# Altium schematic sheet Control.SchDoc
size A4
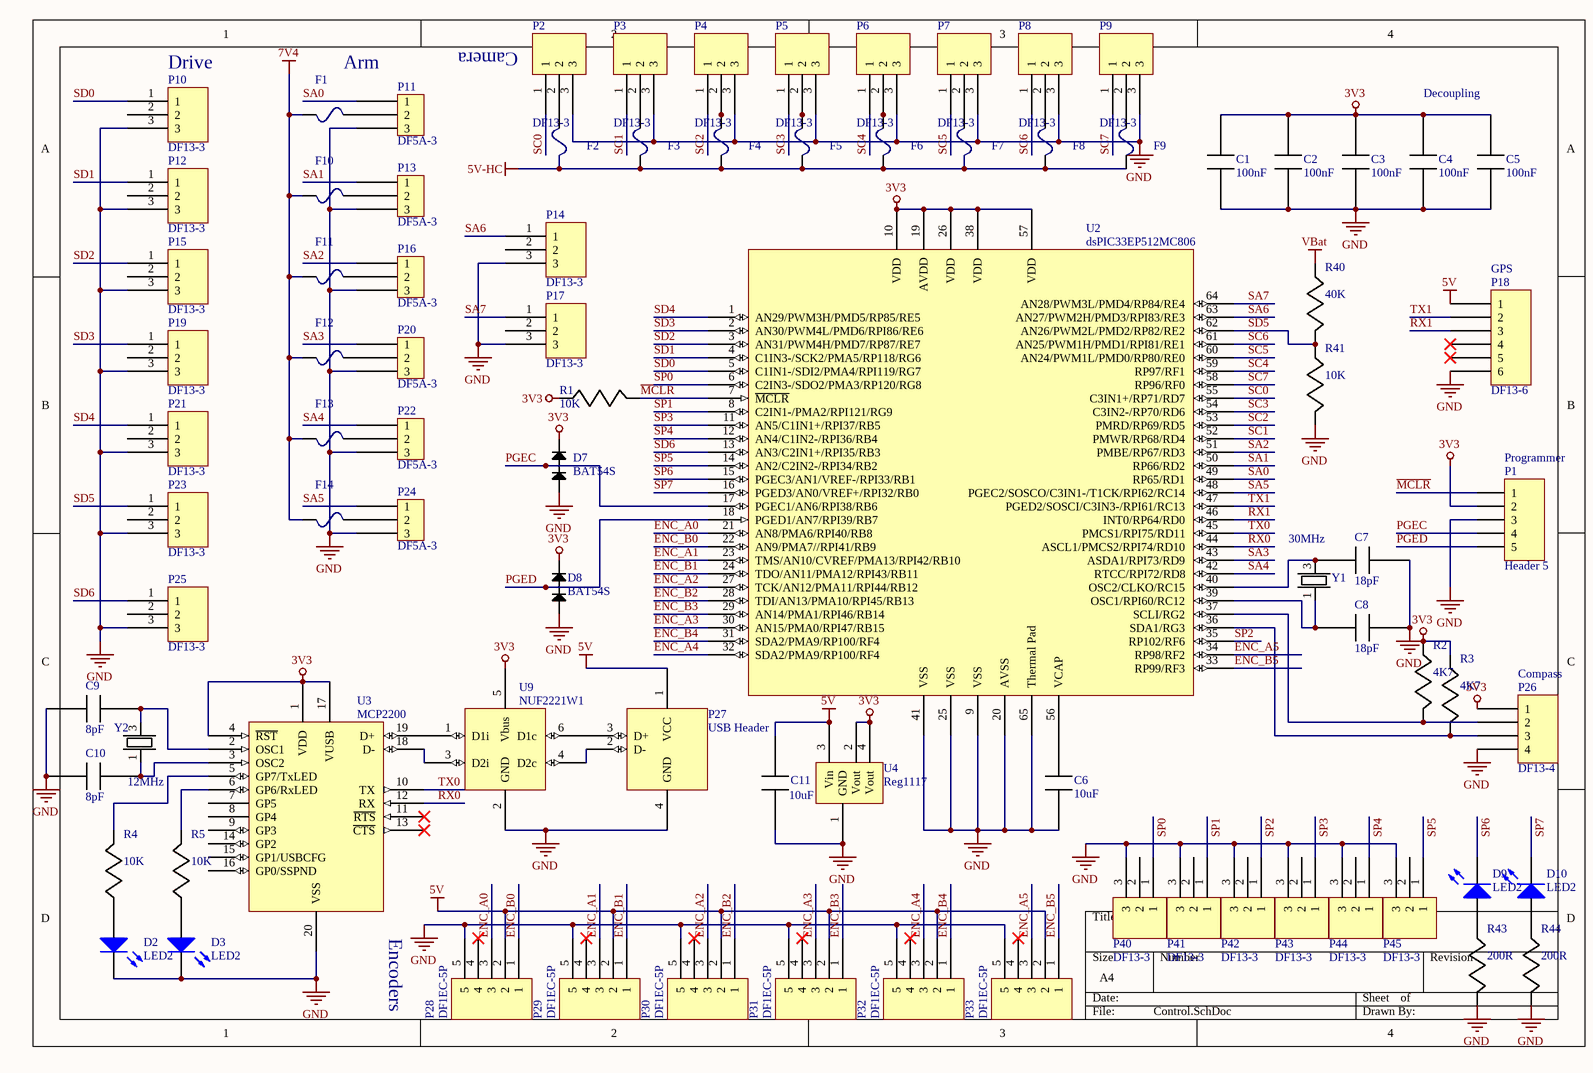
[diagram p0: Control.SchDoc]

## Parts
C1  100nF  [1608[0603]]
C2  100nF  [1608[0603]]
C3  100nF  [1608[0603]]
C4  100nF  [1608[0603]]
C5  100nF  [1608[0603]]
C6  10uF  [1608[0603]]
C7  18pF  [1608[0603]]
C8  18pF  [1608[0603]]
C9  8pF  [1608[0603]]
C10  8pF  [1608[0603]]
C11  Size: 10uF  [1608[0603]]
D2  LED2  [3.2X1.6X1.1]
D3  LED2  [3.2X1.6X1.1]
D7  BAT54S  [SOT90P240X110-3N]
D8  BAT54S  [SOT90P240X110-3N]
D9  LED2  [1608[0603]]
D10  LED2  [1608[0603]]
F1  RSTA 2-BULK  [56400001009]  (value not drawn)
F2  RSTA 2-BULK  [56400001009]  (value not drawn)
F3  RSTA 2-BULK  [56400001009]  (value not drawn)
F4  RSTA 2-BULK  [56400001009]  (value not drawn)
F5  RSTA 2-BULK  [56400001009]  (value not drawn)
F6  RSTA 2-BULK  [56400001009]  (value not drawn)
F7  RSTA 2-BULK  [56400001009]  (value not drawn)
F8  RSTA 2-BULK  [56400001009]  (value not drawn)
F9  RSTA 2-BULK  [56400001009]  (value not drawn)
F10  RSTA 2-BULK  [56400001009]  (value not drawn)
F11  RSTA 2-BULK  [56400001009]  (value not drawn)
F12  RSTA 2-BULK  [56400001009]  (value not drawn)
F13  RSTA 2-BULK  [56400001009]  (value not drawn)
F14  RSTA 2-BULK  [56400001009]  (value not drawn)
P1  Header 5  [HDR1X5]
P2  DF13-3  [DF13-3]
P3  DF13-3  [DF13-3]
P4  DF13-3  [DF13-3]
P5  DF13-3  [DF13-3]
P6  DF13-3  [DF13-3]
P7  DF13-3  [DF13-3]
P8  DF13-3  [DF13-3]
P9  DF13-3  [DF13-3]
P10  DF13-3  [DF13-3]
P11  DF5A-3  [DF5A-3]
P12  DF13-3  [DF13-3]
P13  DF5A-3  [DF5A-3]
P14  DF13-3  [DF13-3]
P15  DF13-3  [DF13-3]
P16  DF5A-3  [DF5A-3]
P17  DF13-3  [DF13-3]
P18  DF13-6  [DF13-6S-1.25H]
P19  DF13-3  [DF13-3]
P20  DF5A-3  [DF5A-3]
P21  DF13-3  [DF13-3]
P22  DF5A-3  [DF5A-3]
P23  DF13-3  [DF13-3]
P24  DF5A-3  [DF5A-3]
P25  DF13-3  [DF13-3]
P26  DF13-4  [DF13-4S-1.25H]
P27  USB Header  [USB-B]
P28  DF1EC-5P  [DF1EC-4P]
P29  DF1EC-5P  [DF1EC-4P]
P30  DF1EC-5P  [DF1EC-4P]
P31  DF1EC-5P  [DF1EC-4P]
P32  DF1EC-5P  [DF1EC-4P]
P33  DF1EC-5P  [DF1EC-4P]
P40  DF13-3  [DF13-3]
P41  DF13-3  [DF13-3]
P42  DF13-3  [DF13-3]
P43  DF13-3  [DF13-3]
P44  DF13-3  [DF13-3]
P45  DF13-3  [DF13-3]
R1  Size: 10K  [1608[0603]]
R2  Size: 4K7  [1608[0603]]
R3  Size: 4K7  [1608[0603]]
R4  Size: 10K  [1608[0603]]
R5  Size: 10K  [1608[0603]]
R40  Size: 40K  [1608[0603]]
R41  Size: 10K  [1608[0603]]
R43  Size: 200R  [1608[0603]]
R44  Size: 200R  [1608[0603]]
U2  dsPIC33EP512MC806  [QFN50P900X900X100_HS-65N]
U3  MCP2200  [SOP65P780X200-20N]
U4  Reg1117  [SOT230P700X180-4N]
U9  NUF2221W1  [TSOP65P210X110-6N]
Y1  value 30MHz  [7M-30.000MBBK-T]  (hidden comment: NX5032GC)
Y2  value 12MHz  [NX5032GC]  (hidden comment: NX5032GC)

## Nets
3V3: C1.2 C2.2 C3.2 C4.2 C5.2 D7.2(D1i) D8.2(D1i) P1.2 P26.1 R1.2 R2.2 R3.2 U2.10(VDD) U2.19(AVDD) U2.26(VDD) U2.38(VDD) U2.57(VDD) U3.1(VDD) U3.4(~{RST}) U3.17(VUSB) U4.2(Vout) U4.4(Vout) U9.5(Vbus)
5V: C11.2 P18.1 P27.1(VCC) P28.2 P29.2 P30.2 P31.2 P32.2 P33.2 U4.3(Vin)
5V-HC: F2.2 F3.1 F4.1 F5.1 F6.1 F7.1 F8.1 F9.1
7V4: F1.1 F10.1 F11.1 F12.1 F13.1 F14.1
GND: C1.1 C2.1 C3.1 C4.1 C5.1 C6.1 C7.1 C8.1 C9.2 C10.2 C11.1 D2.2(K) D3.2(K) D7.1(D1i) D8.1(D1i) P1.3 P2.3 P3.3 P4.3 P5.3 P6.3 P7.3 P8.3 P9.3 P10.3 P11.3 P12.3 P13.3 P14.3 P15.3 P16.3 P17.3 P18.6 P19.3 P20.3 P21.3 P22.3 P23.3 P24.3 P25.3 P26.4 P27.4(GND) P28.5 P29.5 P30.5 P31.5 P32.5 P33.5 P40.3 P41.3 P42.3 P43.3 P44.3 P45.3 R41.1 R43.1 R44.1 U2.9(VSS) U2.20(AVSS) U2.25(VSS) U2.41(VSS) U2.65(Thermal_Pad) U3.20(VSS) U4.1(GND) U9.2(GND)
VBat: R40.2
ENC_A0: P28.3 U2.21(AN8/PMA6/RPI40/RB8)
ENC_A1: P29.3 U2.23(TMS/AN10/CVREF/PMA13/RPI42/RB10)
ENC_A2: P30.3 U2.27(TCK/AN12/PMA11/RPI44/RB12)
ENC_A3: P31.3 U2.30(AN15/PMA0/RPI47/RB15)
ENC_A4: P32.3 U2.32(SDA2/PMA9/RP100/RF4)
ENC_A5: P33.3 U2.34(RP98/RF2)
ENC_B0: P28.1 U2.22(AN9/PMA7//RPI41/RB9)
ENC_B1: P29.1 U2.24(TDO/AN11/PMA12/RPI43/RB11)
ENC_B2: P30.1 U2.28(TDI/AN13/PMA10/RPI45/RB13)
ENC_B3: P31.1 U2.29(AN14/PMA1/RPI46/RB14)
ENC_B4: P32.1 U2.31(SDA2/PMA9/RP100/RF4)
ENC_B5: P33.1 U2.33(RP99/RF3)
~{MCLR}: P1.1 R1.1 U2.7(~{MCLR})
PGEC: D7.3(D1i) P1.4 U2.17(PGEC1/AN6/RPI38/RB6)
PGED: D8.3(D1i) P1.5 U2.18(PGED1/AN7/RPI39/RB7)
RX0: U2.44(ASCL1/PMCS2/RPI74/RD10) U3.12(RX)
RX1: P18.3 U2.46(INT0/RP64/RD0)
SA0: P11.1 U2.49(RP65/RD1)
SA1: P13.1 U2.50(RP66/RD2)
SA2: P16.1 U2.51(PMBE/RP67/RD3)
SA3: P20.1 U2.43(ASDA1/RPI73/RD9)
SA4: P22.1 U2.42(RTCC/RPI72/RD8)
SA5: P24.1 U2.48(PGEC2/SOSCO/C3IN1-/T1CK/RPI62/RC14)
SA6: P14.1 U2.63(AN27/PWM2H/PMD3/RPI83/RE3)
SA7: P17.1 U2.64(AN28/PWM3L/PMD4/RP84/RE4)
SC0: P2.1 U2.55(C3IN1+/RP71/RD7)
SC1: P3.1 U2.52(PMWR/RP68/RD4)
SC2: P4.1 U2.53(PMRD/RP69/RD5)
SC3: P5.1 U2.54(C3IN2-/RP70/RD6)
SC4: P6.1 U2.59(RP97/RF1)
SC5: P7.1 U2.60(AN24/PWM1L/PMD0/RP80/RE0)
SC6: P8.1 U2.61(AN25/PWM1H/PMD1/RPI81/RE1)
SC7: P9.1 U2.58(RP96/RF0)
SD0: P10.1 U2.5(C1IN1-/SDI2/PMA4/RPI119/RG7)
SD1: P12.1 U2.4(C1IN3-/SCK2/PMA5/RP118/RG6)
SD2: P15.1 U2.3(AN31/PWM4H/PMD7/RP87/RE7)
SD3: P19.1 U2.2(AN30/PWM4L/PMD6/RPI86/RE6)
SD4: P21.1 U2.1(AN29/PWM3H/PMD5/RP85/RE5)
SD5: P23.1 R40.1 R41.2 U2.62(AN26/PWM2L/PMD2/RP82/RE2)
SD6: P25.1 U2.13(AN3/C2IN1+/RPI35/RB3)
SP0: P40.1 U2.6(C2IN3-/SDO2/PMA3/RP120/RG8)
SP1: P41.1 U2.8(C2IN1-/PMA2/RPI121/RG9)
SP2: P42.1 U2.35(RP102/RF6)
SP3: P43.1 U2.11(AN5/C1IN1+/RPI37/RB5)
SP4: P44.1 U2.12(AN4/C1IN2-/RPI36/RB4)
SP5: P45.1 U2.14(AN2/C2IN2-/RPI34/RB2)
SP6: D9.2(K) U2.15(PGEC3/AN1/VREF-/RPI33/RB1)
SP7: D10.2(K) U2.16(PGED3/AN0/VREF+/RPI32/RB0)
TX0: U2.45(PMCS1/RPI75/RD11) U3.10(TX)
TX1: P18.2 U2.47(PGED2/SOSCI/C3IN3-/RPI61/RC13)
NetC6_2: C6.2 U2.56(VCAP)
NetC7_2: C7.2 U2.40(OSC2/CLKO/RC15) Y1.3
NetC8_2: C8.2 U2.39(OSC1/RPI60/RC12) Y1.1
NetC9_1: C9.1 U3.2(OSC1) Y2.3
NetC10_1: C10.1 U3.3(OSC2) Y2.1
NetD2_1: D2.1(A) R4.2
NetD3_1: D3.1(A) R5.2
NetD9_1: D9.1(A) R43.2
NetD10_1: D10.1(A) R44.2
NetF1_2: F1.2 P11.2
NetF2_1: F2.1 P2.2
NetF3_2: F3.2 P3.2
NetF4_2: F4.2 P4.2
NetF5_2: F5.2 P5.2
NetF6_2: F6.2 P6.2
NetF7_2: F7.2 P7.2
NetF8_2: F8.2 P8.2
NetF9_2: F9.2 P9.2
NetF10_2: F10.2 P13.2
NetF11_2: F11.2 P16.2
NetF12_2: F12.2 P20.2
NetF13_2: F13.2 P22.2
NetF14_2: F14.2 P24.2
NetP26_2: P26.2 R2.1 U2.37(SCLI/RG2)
NetP26_3: P26.3 R3.1 U2.36(SDA1/RG3)
NetP27_2: P27.2(D-) U9.4(D2c)
NetP27_3: P27.3(D+) U9.6(D1c)
NetR4_1: R4.1 U3.5(GP7/TxLED)
NetR5_1: R5.1 U3.6(GP6/RxLED)
NetU3_18: U3.18(D-) U9.3(D2i)
NetU3_19: U3.19(D+) U9.1(D1i)

Not connected (* = marked no-connect by the designer): P10 2; P12 2; P14 2; P15 2; P17 2; P18 4* 5*; P19 2; P21 2; P23 2; P25 2; P28 4*; P29 4*; P30 4*; P31 4*; P32 4*; P33 4*; P40 2; P41 2; P42 2; P43 2; P44 2; P45 2; U3 7(GP5) 8(GP4) 9(GP3) 11(~{RTS})* 13(~{CTS})* 14(GP2) 15(GP1/USBCFG) 16(GP0/SSPND)

## Notes on the sheet
- (near P2) Camera
- (near P10) Drive
- Arm
- Decoupling
- (near P18) GPS
- (near P1) Programmer
- (near P26) Compass
- (near U3) Encoders

## Library data of the parts
C1-C11 = Capacitor
D2 D3 D9 D10 = LED2: Typical RED, GREEN, YELLOW, AMBER GaAs LED; Published: 8-Jun-2000; LatestRevisionDate: 17-Jul-2002; LatestRevisionNote: Re-released for DXP Platform.; PackageVersion: Feb-2002; PackageReference: 3.2X1.6X1.1; Publisher: Altium Limited; PackageDescription: SM LED; 2 Flat Leads
F1-F14 = RSTA 2-BULK: FUSE 2A 250/277V RADIAL
P1 = Header 5: Header, 5-Pin; LatestRevisionDate: 17-Jul-2002; LatestRevisionNote: Re-released for DXP Platform.; Publisher: Altium Limited
R1-R5 R40 R41 R43 R44 = Resistor